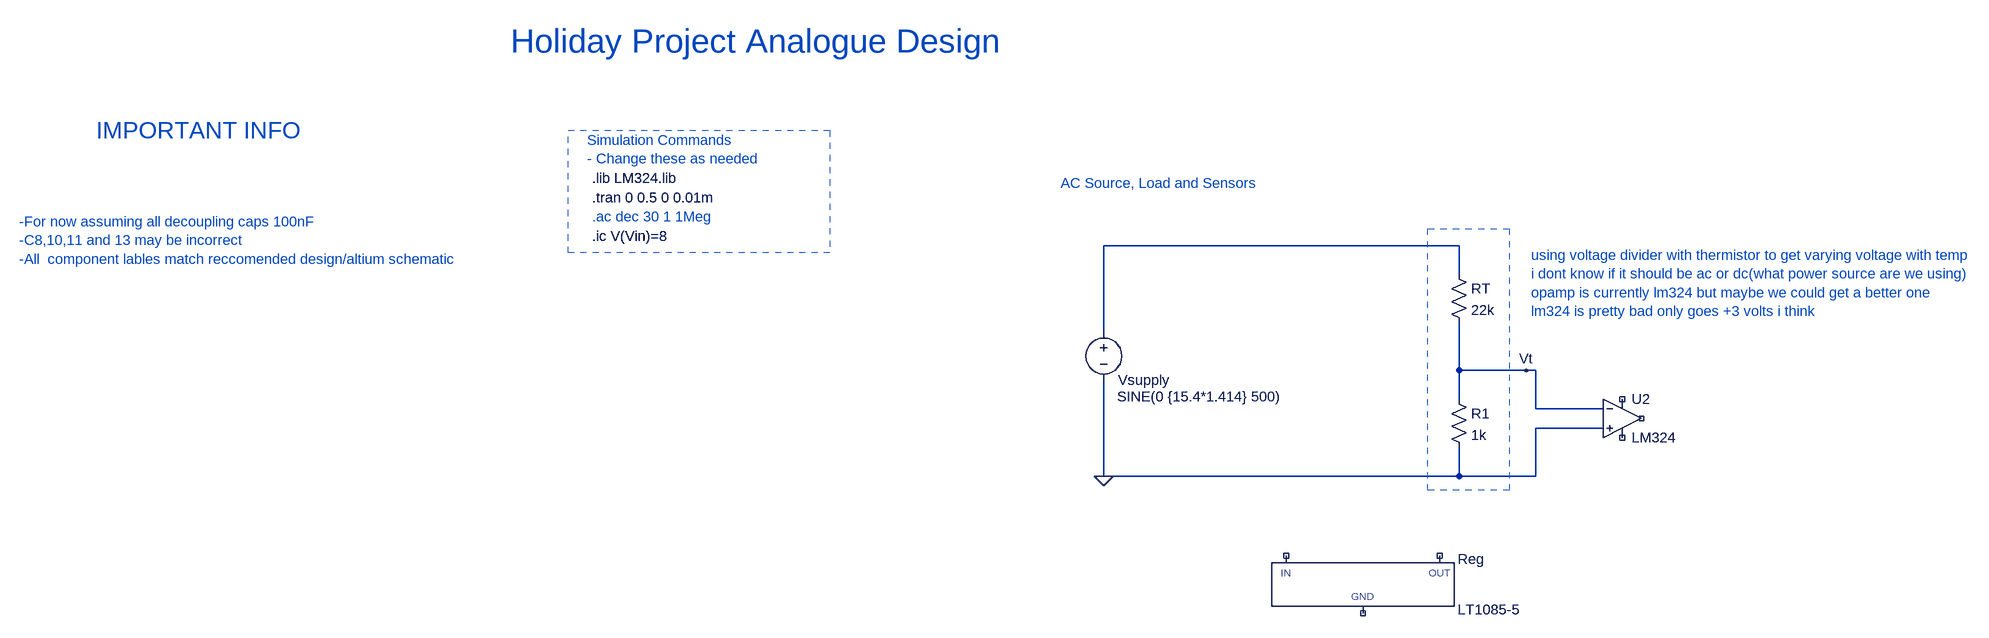
[diagram p0: schematic test_schematic.asc]
test_schematic.asc, the LTspice schematic file:
Version 4.1
SHEET 1 3696 2980
WIRE 1024 -16 432 -16
WIRE 1024 32 1024 -16
WIRE 432 128 432 -16
WIRE 1024 192 1024 112
WIRE 1136 192 1024 192
WIRE 1152 192 1136 192
WIRE 1024 240 1024 192
WIRE 1152 256 1152 192
WIRE 1264 256 1152 256
WIRE 1264 288 1152 288
WIRE 432 368 432 208
WIRE 1024 368 1024 320
WIRE 1024 368 432 368
WIRE 1152 368 1152 288
WIRE 1152 368 1024 368
FLAG 1136 192 Vt
FLAG 432 368 0
SYMBOL voltage 432 112 R0
WINDOW 0 24 96 Left 2
WINDOW 3 22 124 Left 2
WINDOW 123 0 0 Left 0
WINDOW 39 0 0 Left 0
SYMATTR InstName Vsupply
SYMATTR Value SINE(0 {15.4*1.414} 500)
SYMBOL PowerProducts/LT1085-5 864 1424 R0
SYMATTR InstName Reg
SYMBOL res 1008 16 R0
SYMATTR InstName RT
SYMATTR Value 22k
SYMBOL res 1008 224 R0
SYMATTR InstName R1
SYMATTR Value 1k
SYMBOL OpAmps\\opamp2 1296 208 R0
SYMATTR InstName U2
SYMATTR Value LM324
TEXT -864 -64 Left 2 ;.ac dec 30 1 1Meg
TEXT -864 -128 Left 2 !.lib LM324.lib
TEXT 360 -120 Left 2 ;AC Source, Load and Sensors
TEXT -872 -192 Left 2 ;Simulation Commands\n- Change these as needed
TEXT -864 -96 Left 2 !.tran 0 0.5 0 0.01m
TEXT -864 -32 Left 2 !.ic V(Vin)=8
TEXT -1000 -392 Left 5 ;Holiday Project Analogue Design
TEXT -1864 -56 Left 2 ;-For now assuming all decoupling caps 100nF\n-C8,10,11 and 13 may be incorrect\n-All  component lables match reccomended design/altium schematic
TEXT -1736 -208 Left 4 ;IMPORTANT INFO
TEXT 1144 0 Left 2 ;using voltage divider with thermistor to get varying voltage with temp\ni dont know if it should be ac or dc(what power source are we using)\nopamp is currently lm324 but maybe we could get a better one\nlm324 is pretty bad only goes +3 volts i think
RECTANGLE Normal 972 -44 1108 392 2
RECTANGLE Normal -904 -208 -468 -4 2

The netlist it stands for:
* test_schematic.asc
Vsupply N001 0 SINE(0 {15.4*1.414} 500)
X§Reg NC_01 NC_02 NC_03 LT1085-5  ; pins GND OUT IN
RT N001 Vt 22k
R1 Vt 0 1k
X§U2 0 Vt NC_04 NC_05 NC_06 LM324  ; pins In+ In- V+ V- OUT
* .ac dec 30 1 1Meg
.lib LM324.lib
* AC Source, Load and Sensors
* Simulation Commands
* - Change these as needed
.tran 0 0.5 0 0.01m
.ic V(Vin)=8
* Holiday Project Analogue Design
* -For now assuming all decoupling caps 100nF
* -C8,10,11 and 13 may be incorrect
* -All  component lables match reccomended design/altium schematic
* IMPORTANT INFO
* using voltage divider with thermistor to get varying voltage with temp
* i dont know if it should be ac or dc(what power source are we using)
* opamp is currently lm324 but maybe we could get a better one
* lm324 is pretty bad only goes +3 volts i think
.backanno
.end